# EAGLE schematic MSPBOIADV (EAGLE 9.3.0)
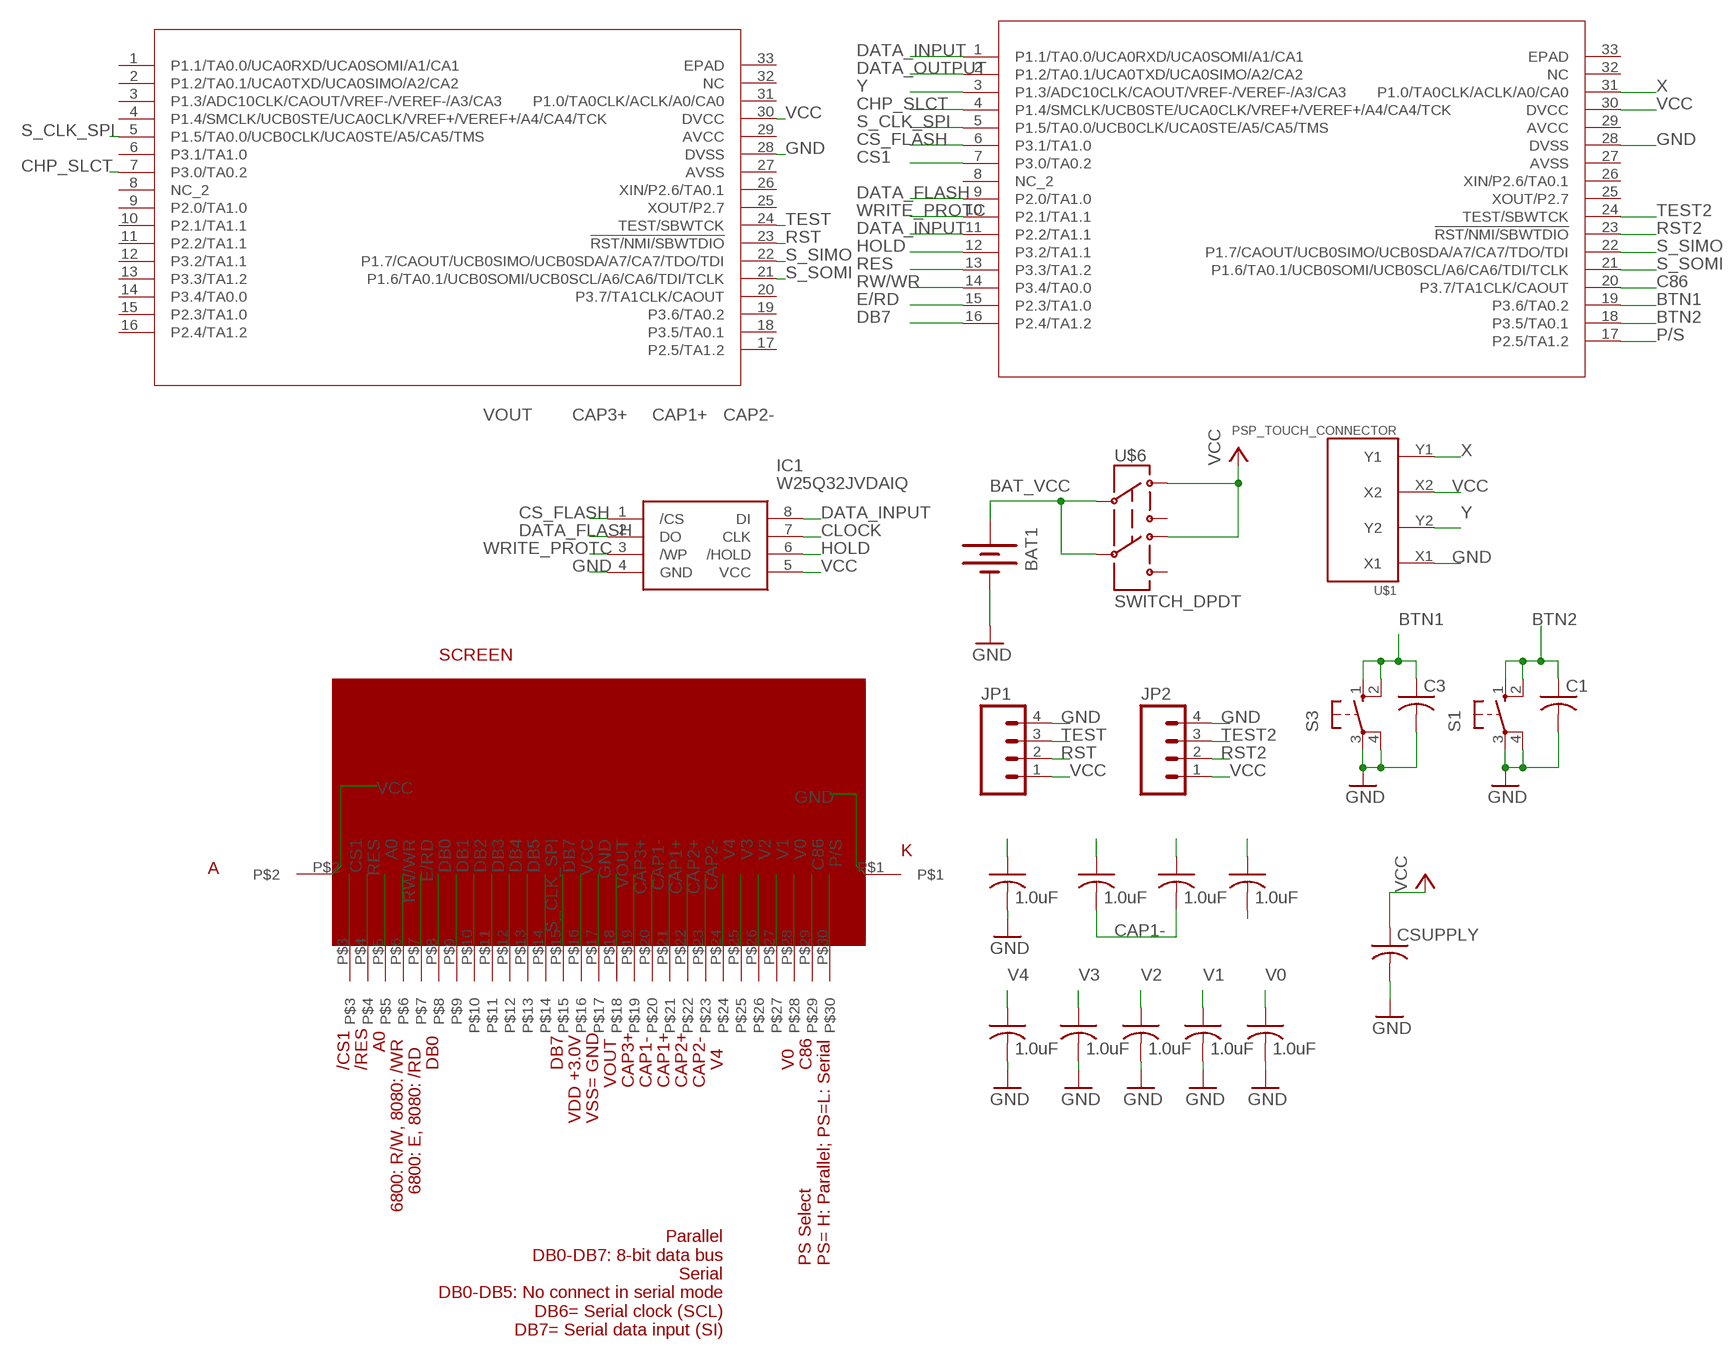
[diagram p0: schematic, sheet 1]

## Parts
1.0UF  1.0uF  C-USC1206  [C1206]
1.0UF1  1.0uF  C-USC1206  [C1206]
BAT1  BATTERY  [BATTERY_PACK_2AA]
C1  C-USC1206  [C1206]
C3  C-USC1206  [C1206]
CSUPPLY  C-USC1206  [C1206]
IC1  W25Q32JVDAIQ  [DIP902W46P254L959H533Q8N]
JP1  M04LOCK  [1X04_LOCK]
JP2  M04LOCK  [1X04_LOCK]
S1  10-XX  [B3F-10XX]
S3  10-XX  [B3F-10XX]
U1  MSP430G2553IRHB32T  [RHB32_3P45X3P45]
U2  MSP430G2553IRHB32T  [RHB32_3P45X3P45]
U$1  PSP_TOUCH_CONNECTOR  [PSP_TOUCH_CONNECTOR]
U$2  SCREEN  [DISPLAY_128_64]
U$6  SWITCH_DPDT  [JS_DPDT_TH]
VOUTCAP  1.0uF  C-USC1206  [C1206]
VOUTCAP1  1.0uF  C-USC1206  [C1206]
VOUTCAP2  1.0uF  C-USC1206  [C1206]
VOUTCAP3  1.0uF  C-USC1206  [C1206]
VOUTCAP4  1.0uF  C-USC1206  [C1206]
VOUTCAP5  1.0uF  C-USC1206  [C1206]
VOUTCAP6  1.0uF  C-USC1206  [C1206]

## Nets
A0: U$2.P$5
BAT_VCC: BAT1.3V(+) U$6.2 U$6.5
BTN1: C3.1 S3.1(S) S3.2(S1) U2.19(P3.6/TA0.2)
BTN2: C1.1 S1.1(S) S1.2(S1) U2.18(P3.5/TA0.1)
C86: U2.20(P3.7/TA1CLK/CAOUT) U$2.P$29
CAP1+: 1.0UF1.1 U$2.P$21
CAP1-: 1.0UF1.2 1.0UF.2 U$2.P$20
CAP2+: U$2.P$22 VOUTCAP1.2
CAP2-: U$2.P$23 VOUTCAP1.1
CAP3+: 1.0UF.1 U$2.P$19
CHP_SLCT: U1.7(P3.0/TA0.2) U2.4(P1.4/SMCLK/UCB0STE/UCA0CLK/VREF+/VEREF+/A4/CA4/TCK)
CLOCK: IC1.7(CLK)
CS1: U2.7(P3.0/TA0.2) U$2.P$3
CS_FLASH: IC1.1(/CS) U2.6(P3.1/TA1.0)
DATA_FLASH: IC1.2(DO) U2.9(P2.0/TA1.0)
DATA_INPUT: IC1.8(DI) U2.1(P1.1/TA0.0/UCA0RXD/UCA0SOMI/A1/CA1) U2.11(P2.2/TA1.1)
DATA_OUTPUT: U2.2(P1.2/TA0.1/UCA0TXD/UCA0SIMO/A2/CA2)
DB0: U$2.P$8
DB1: U$2.P$9
DB2: U$2.P$10
DB3: U$2.P$11
DB4: U$2.P$12
DB5: U$2.P$13
DB7: U2.16(P2.4/TA1.2) U$2.P$15
E/RD: U2.15(P2.3/TA1.0) U$2.P$7
GND: BAT1.GND(-) C1.2 C3.2 CSUPPLY.2 IC1.4(GND) JP1.4 JP2.4 S1.3(P) S1.4(P1) S3.3(P) S3.4(P1) U1.28(DVSS) U2.28(DVSS) U$1.X1 U$2.P$1 U$2.P$17 VOUTCAP2.2 VOUTCAP3.2 VOUTCAP4.2 VOUTCAP5.2 VOUTCAP6.2 VOUTCAP.2
HOLD: IC1.6(/HOLD) U2.12(P3.2/TA1.1)
P/S: U2.17(P2.5/TA1.2) U$2.P$30
RES: U2.13(P3.3/TA1.2) U$2.P$4
RST: JP1.2 U1.23(!RST/NMI/SBWTDIO)
RST2: JP2.2 U2.23(!RST/NMI/SBWTDIO)
RW/WR: U2.14(P3.4/TA0.0) U$2.P$6
S_CLK_SPI: U1.5(P1.5/TA0.0/UCB0CLK/UCA0STE/A5/CA5/TMS) U2.5(P1.5/TA0.0/UCB0CLK/UCA0STE/A5/CA5/TMS) U$2.P$14
S_SIMO: U1.22(P1.7/CAOUT/UCB0SIMO/UCB0SDA/A7/CA7/TDO/TDI) U2.22(P1.7/CAOUT/UCB0SIMO/UCB0SDA/A7/CA7/TDO/TDI)
S_SOMI: U1.21(P1.6/TA0.1/UCB0SOMI/UCB0SCL/A6/CA6/TDI/TCLK) U2.21(P1.6/TA0.1/UCB0SOMI/UCB0SCL/A6/CA6/TDI/TCLK)
TEST: JP1.3 U1.24(TEST/SBWTCK)
TEST2: JP2.3 U2.24(TEST/SBWTCK)
V0: U$2.P$28 VOUTCAP6.1
V1: U$2.P$27 VOUTCAP5.1
V2: U$2.P$26 VOUTCAP4.1
V3: U$2.P$25 VOUTCAP3.1
V4: U$2.P$24 VOUTCAP2.1
VCC: CSUPPLY.1 IC1.5(VCC) JP1.1 JP2.1 U1.30(DVCC) U2.30(DVCC) U$1.X2 U$2.P$2 U$2.P$16 U$6.1 U$6.4
VOUT: U$2.P$18 VOUTCAP.1
WRITE_PROTC: IC1.3(/WP) U2.10(P2.1/TA1.1)
X: U2.31(P1.0/TA0CLK/ACLK/A0/CA0) U$1.Y1
Y: U2.3(P1.3/ADC10CLK/CAOUT/VREF-/VEREF-/A3/CA3) U$1.Y2
Unconnected: U1.1(P1.1/TA0.0/UCA0RXD/UCA0SOMI/A1/CA1) U1.2(P1.2/TA0.1/UCA0TXD/UCA0SIMO/A2/CA2) U1.3(P1.3/ADC10CLK/CAOUT/VREF-/VEREF-/A3/CA3) U1.4(P1.4/SMCLK/UCB0STE/UCA0CLK/VREF+/VEREF+/A4/CA4/TCK) U1.6(P3.1/TA1.0) U1.8(NC_2) U1.9(P2.0/TA1.0) U1.10(P2.1/TA1.1) U1.11(P2.2/TA1.1) U1.12(P3.2/TA1.1) U1.13(P3.3/TA1.2) U1.14(P3.4/TA0.0) U1.15(P2.3/TA1.0) U1.16(P2.4/TA1.2) U1.17(P2.5/TA1.2) U1.18(P3.5/TA0.1) U1.19(P3.6/TA0.2) U1.20(P3.7/TA1CLK/CAOUT) U1.25(XOUT/P2.7) U1.26(XIN/P2.6/TA0.1) U1.31(P1.0/TA0CLK/ACLK/A0/CA0) U1.32(NC) U1.33(EPAD) U2.8(NC_2) U2.25(XOUT/P2.7) U2.26(XIN/P2.6/TA0.1) U2.32(NC) U2.33(EPAD) U$6.3 U$6.6

## Power pins joined to a net without a drawn wire
AVCC: U1.29(AVCC) U2.29(AVCC)
AVSS: U1.27(AVSS) U2.27(AVSS)

## Library data of the parts
1.0UF 1.0UF1 C1 C3 VOUTCAP VOUTCAP1-VOUTCAP6 = rcl:C-US: CAPACITOR, American symbol; SPICEPREFIX: C
BAT1 = ELEC327:BATTERY: Battery Holders Various common sizes : AA, AAA, 20mm coin cell and 12mm coin cell. 20MM_4LEGS, BATT-10373
CSUPPLY = rcl:C-US: CAPACITOR, American symbol
IC1 = W25Q32JVDAIQ:W25Q32JVDAIQ: NOR Flash spiFlash, 32M-bit, DTR, 4Kb Uniform Sector Source: Datasheet <https://mouser.componentsearchengine.com/Datasheets/1/W25Q32JVDAIQ.pdf>; DESCRIPTION: NOR Flash spiFlash, 32M-bit, DTR, 4Kb Uniform Sector; HEIGHT: 5.33mm; MANUFACTURER_NAME: Winbond; MANUFACTURER_PART_NUMBER: W25Q32JVDAIQ
JP1 JP2 = SparkFun:M04: Header 4 Standard 4-pin 0.1" header. Use with straight break away headers (SKU : PRT-00116), right angle break away headers (PRT-00553), swiss pins (PRT-00743), machine pins (PRT-00117), and female headers (PRT-00115). Molex polarized connector foot print use with SKU : PRT-08231 with associated crimp pins and housings.
S1 S3 = switch-omron:10-XX: OMRON SWITCH; MPN: B3F-1000; OC_FARNELL: 176432; OC_NEWARK: 36M3542
U1 U2 = ELEC327:MSP430G2553IRHB32T; MANUFACTURER_PART_NUMBER: MSP430G2553IRHB32T; VENDOR: Texas Instruments
U$1 = SparkFun:PSP_TOUCH_CONNECTOR: 4-Pin Connector for PSP Touch Screen
U$2 = gameconsole:SCREEN
U$6 = ELEC327:SWITCH_DPDT